# EAGLE design Adafruit Airlift Bitsy Add-On (EAGLE 9.4.2)
COMPANY: ADAFRUIT INDUSTRIES; DRAWN: KTOWN; REV: B
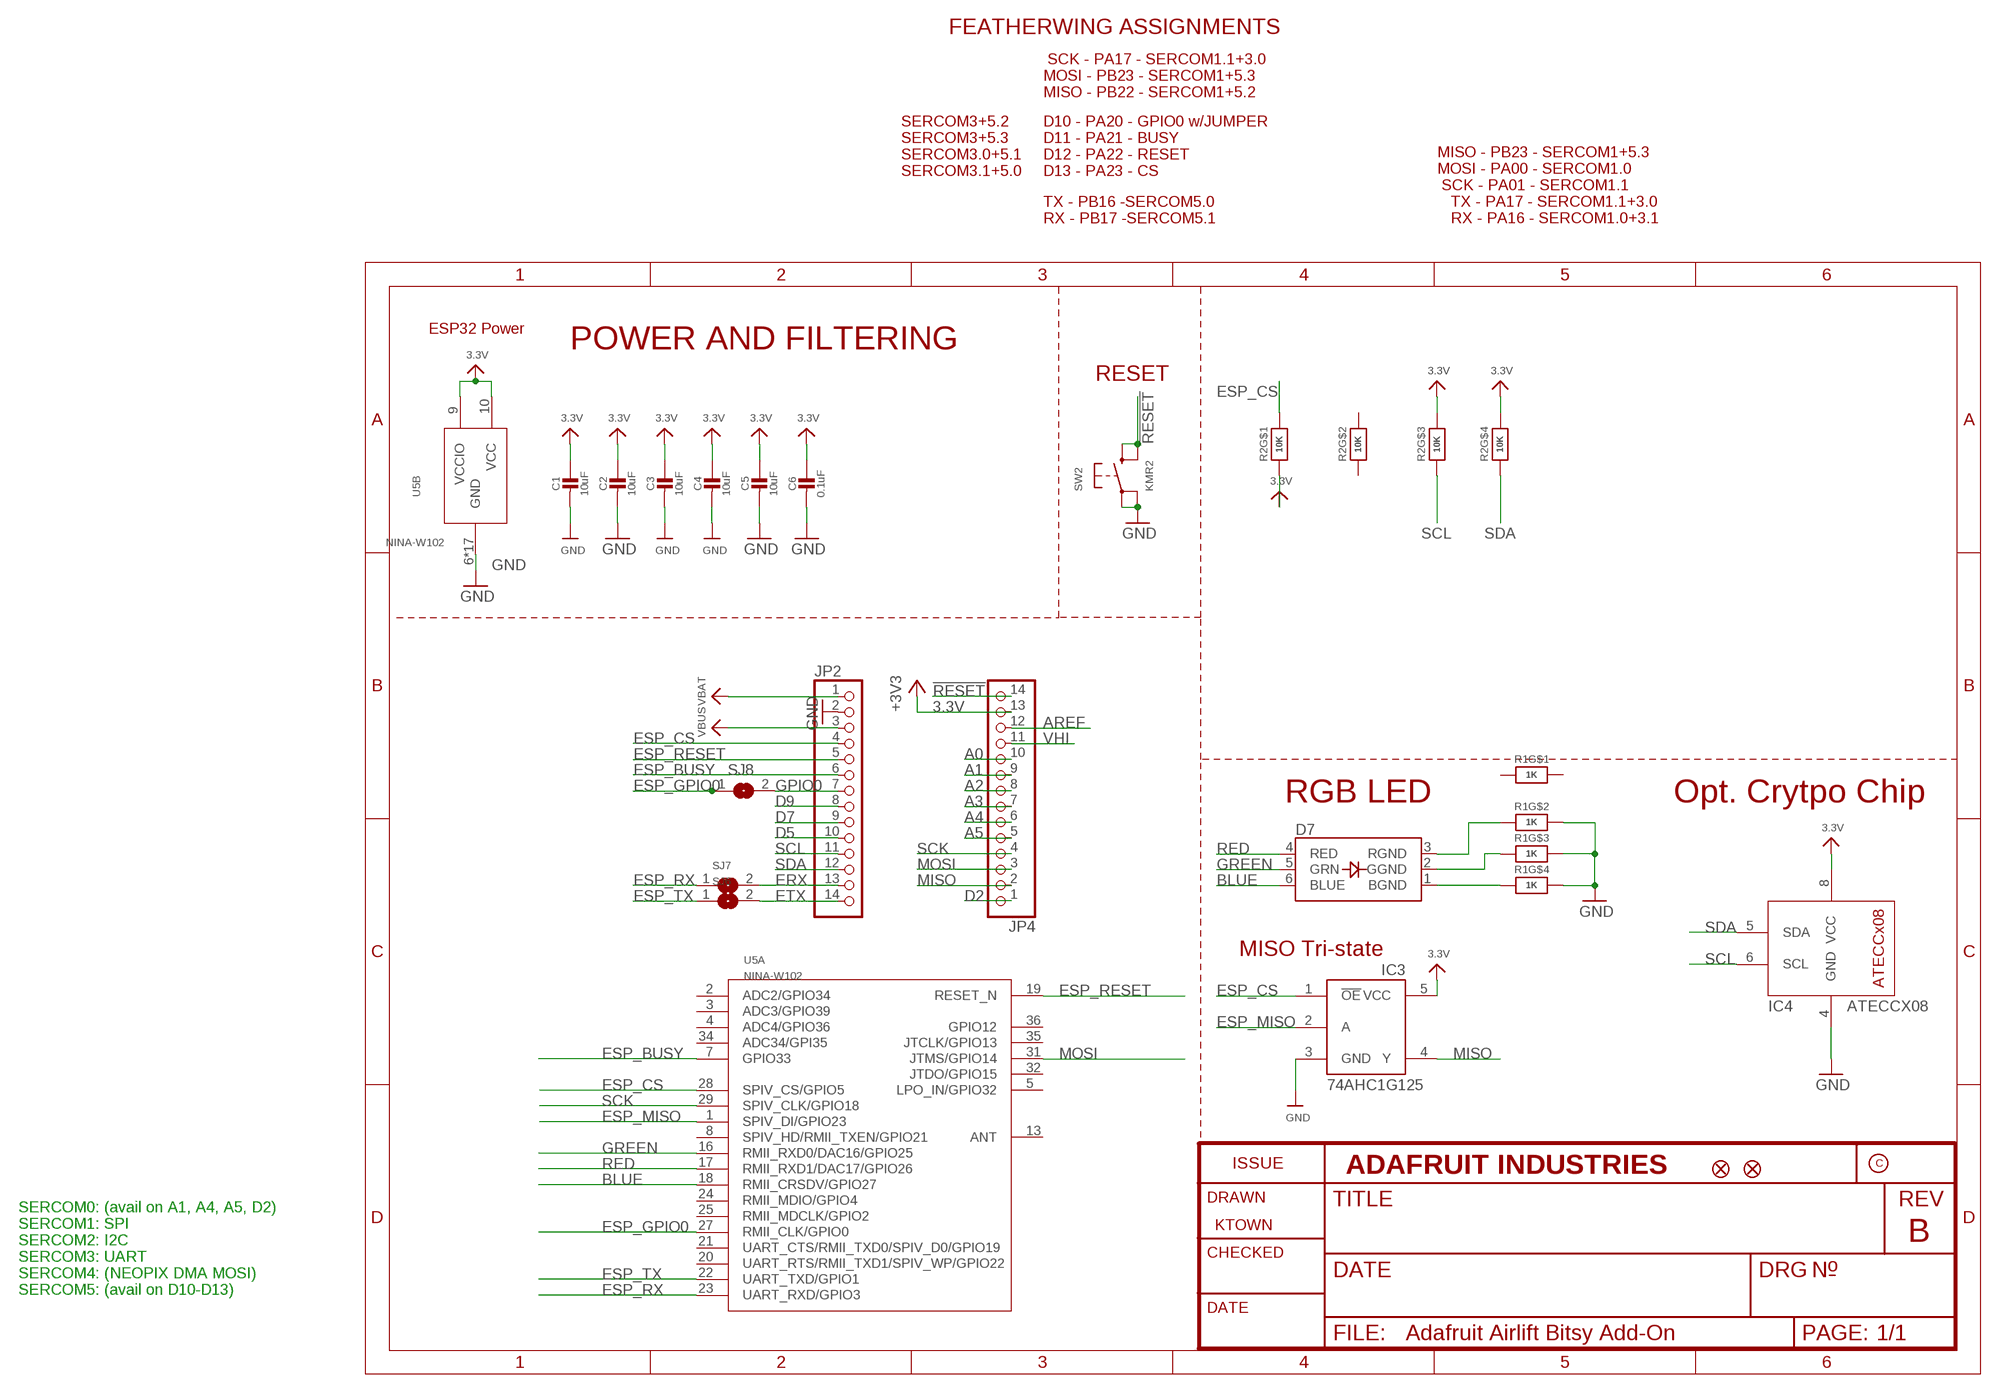
[diagram p0: schematic, sheet 1]

## Parts
C1  10uF  CAP_CERAMIC0805-NOOUTLINE  [0805-NO]
C2  10uF  CAP_CERAMIC0805-NOOUTLINE  [0805-NO]
C3  10uF  CAP_CERAMIC0805-NOOUTLINE  [0805-NO]
C4  10uF  CAP_CERAMIC0805-NOOUTLINE  [0805-NO]
C5  10uF  CAP_CERAMIC0805-NOOUTLINE  [0805-NO]
C6  0.1uF  CAP_CERAMIC0603_NO  [0603-NO]
D7  LED_RGB_PLCC63535  [RGBLED_3535_PLCC6]
IC3  74AHC1G125  [SOT23-5L]
IC4  ATECCX08  [SOIC8_150MIL]
JP2  HEADER-1X14  [1X14_ROUND70]
JP4  HEADER-1X14  [1X14_ROUND70]
R1  1K  RESISTOR_4PACK_NO  [RESPACK_4X0603_NO]
R2  10K  RESISTOR_4PACK_NO  [RESPACK_4X0603_NO]
SJ6  SOLDERJUMPER  [SOLDERJUMPER_ARROW_NOPASTE]
SJ7  SOLDERJUMPER  [SOLDERJUMPER_ARROW_NOPASTE]
SJ8  SOLDERJUMPER  [SOLDERJUMPER_ARROW_NOPASTE]
SW2  KMR2  SWITCH_TACT_SMT4.6X2.8  [BTN_KMR2_4.6X2.8]
U5  NINA-W102  NINA-W10X-102NINA-W10X  [ARDUINO-UCS&SOCS_NINA-W1X]
U$34  FIDUCIAL_1MM  [FIDUCIAL_1MM]
U$35  FIDUCIAL_1MM  [FIDUCIAL_1MM]

## Nets
3.3V: C1.1 C2.1 C3.1 C4.1 C5.1 C6.1 IC3.5(VCC) IC4.8(VCC) JP4.13 R2.1 R2.5 R2.6 U5.9(B:VCCIO) U5.10(B:VCC) ; supply symbol labelled +3V3
!RESET: JP4.14 SW2.B'(S1) SW2.B(S)
A0: JP4.10
A1: JP4.9
A2: JP4.8
A3: JP4.7
A4: JP4.6
A5: JP4.5
AREF: JP4.12
BLUE: D7.6(BLUE) U5.18(A:RMII_CRSDV/GPIO27)
D2: JP4.1
D5: JP2.10
D7: JP2.9
D9: JP2.8
ERX: JP2.13 SJ7.2
ESP_BUSY: JP2.6 U5.7(A:GPIO33)
ESP_CS: IC3.1(!OE) JP2.4 R2.8 U5.28(A:SPIV_CS/GPIO5)
ESP_GPIO0: SJ8.1 U5.27(A:RMII_CLK/GPIO0)
ESP_MISO: IC3.2(A) U5.1(A:SPIV_DI/GPIO23)
ESP_RESET: JP2.5 U5.19(A:RESET_N)
ESP_RX: SJ7.1 U5.23(A:UART_RXD/GPIO3)
ESP_TX: SJ6.1 U5.22(A:UART_TXD/GPIO1)
ETX: JP2.14 SJ6.2
GND: C1.2 C2.2 C3.2 C4.2 C5.2 C6.2 IC3.3(GND) IC4.4(GND) JP2.2 R1.5 R1.6 R1.7 SW2.A'(P1) SW2.A(P) U5.6(B:GND) U5.12(B:GND) U5.14(B:GND) U5.26(B:GND) U5.30(B:GND) U5.GND@1(B:GND) U5.GND@2(B:GND) U5.GND@3(B:GND) U5.GND@4(B:GND) U5.GND@5(B:GND) U5.GND@6(B:GND) U5.GND@7(B:GND) U5.GND@8(B:GND) U5.GND@9(B:GND) U5.GND@10(B:GND) U5.GND@11(B:GND) U5.GND@12(B:GND)
GPIO0: JP2.7 SJ8.2
GREEN: D7.5(GRN) U5.16(A:RMII_RXD0/DAC16/GPIO25)
MISO: IC3.4(Y) JP4.2
MOSI: JP4.3 U5.31(A:JTMS/GPIO14)
N$5: D7.1(BGND) R1.4
N$6: D7.2(GGND) R1.3
N$7: D7.3(RGND) R1.2
RED: D7.4(RED) U5.17(A:RMII_RXD1/DAC17/GPIO26)
SCK: JP4.4 U5.29(A:SPIV_CLK/GPIO18)
SCL: IC4.6(SCL) JP2.11 R2.3
SDA: IC4.5(SDA) JP2.12 R2.4
VBAT: JP2.1
VBUS: JP2.3
VHI: JP4.11
Unconnected: R1.1 R1.8 R2.2 R2.7 U5.2(A:ADC2/GPIO34) U5.3(A:ADC3/GPIO39) U5.4(A:ADC4/GPIO36) U5.5(A:LPO_IN/GPIO32) U5.8(A:SPIV_HD/RMII_TXEN/GPIO21) U5.13(A:ANT) U5.20(A:UART_RTS/RMII_TXD1/SPIV_WP/GPIO22) U5.21(A:UART_CTS/RMII_TXD0/SPIV_D0/GPIO19) U5.24(A:RMII_MDIO/GPIO4) U5.25(A:RMII_MDCLK/GPIO2) U5.32(A:JTDO/GPIO15) U5.34(A:ADC34/GPI35) U5.35(A:JTCLK/GPIO13) U5.36(A:GPIO12)

## Notes on the sheet
- FEATHERWING ASSIGNMENTS
- SCK - PA17 - SERCOM1.1+3.0
  MOSI - PB23 - SERCOM1+5.3
  MISO - PB22 - SERCOM1+5.2
- SERCOM3+5.2
  SERCOM3+5.3
  SERCOM3.0+5.1
  SERCOM3.1+5.0
- D10 - PA20 - GPIO0 w/JUMPER
  D11 - PA21 - BUSY
  D12 - PA22 - RESET
  D13 - PA23 - CS
- TX - PB16 -SERCOM5.0
  RX - PB17 -SERCOM5.1
- MISO - PB23 - SERCOM1+5.3
  MOSI - PA00 - SERCOM1.0
   SCK - PA01 - SERCOM1.1
     TX - PA17 - SERCOM1.1+3.0  
     RX - PA16 - SERCOM1.0+3.1
- ESP32 Power
- POWER AND FILTERING
- RESET
- RGB LED | Opt. Crytpo Chip
- MISO Tri-state
- SERCOM0: (avail on A1, A4, A5, D2)
  SERCOM1: SPI
  SERCOM2: I2C
  SERCOM3: UART
  SERCOM4: (NEOPIX DMA MOSI)
  SERCOM5: (avail on D10-D13)

## Library data of the parts
C1-C6 = microbuilder:CAP_CERAMIC: Ceramic Capacitors For new designs, use the packages preceded by an '_' character since they are more reliable: The following footprints should be used on most boards: _0402 - Standard footprint for regular board layouts _0603 - Standard footprint for regular board layouts _0805 - Standard footprint for regular board layouts _1206 - Standard footprint for regular board layouts For extremely tight-pitch boards where space is at a premium, the following 'micro-pitch' footprints can be used (smaller pads, no silkscreen outline, etc.): _0402MP - Micro-pitch footprint for very dense/compact boards _0603MP - Micro-pitch footprint for very dense/compact boards _0805MP - Micro-pitch footprint for very dense/compact boards _1206MP - Micro-pitch footprint for very dense/compact boards
D7 = microbuilder:LED_RGB_PLCC6: RGB LED Cree CLV6A-FKB - Digikey: CLV6A-FKB-CK1P1G1BB7R3R3TR-ND DC Foreward Current: 20mA Foreward Voltage: R = 2.0, G = 3.2, B = 3.2 Viewing Angle: 120°
IC3 = adafruit:74AHC1G125
IC4 = microbuilder:ATECCX08
JP2 JP4 = microbuilder:HEADER-1X14
R1 R2 = microbuilder:RESISTOR_4PACK: Resistor Packs (4 resistors) 4 x 0603 10K 1/16W - Digikey: YC164J-10KCT-ND
SJ6-SJ8 = microbuilder:SOLDERJUMPER: SMD Solder JUMPER Solder the two pads together to create a connection, or remove the solder to break it. REFLOW - Use this footprint for solder paste and reflow ovens. WAVE - Use this footprint for hand-soldering (larger pads). CLOSED - Has a trace between the two pads to ensure it is closed by default. The trace needs to be cut to disable the jumper, and can be closed again by creating a solder bridge between the two pads.; BOM: EXCLUDE
SW2 = microbuilder:SWITCH_TACT_SMT: SMT Tact Switches 6x6mm - Digikey: P12940SCT-ND KMR2 (4.6x2.8mm) - Digikey: 401-1426-1-ND EVQ-PQHB55 - Light Touch, 160GF (4.5x4.5mm) - Digikey: P8090SCT-ND KMT0 - KMT021 NGJ LHS (etc.) IP68/Waterproof - Digikey: CKN10289CT-ND
U5 = microbuilder:NINA-W10X: uBlox NINA-W10X ESP32 WiFi/BLE module Footprint, Symbol, and Object by Arturo Guadalupi for the Arduino MKRWiFi1010 https://content.arduino.cc/assets/MKRWiFi1010-reference.zip BY-SA; CODE-ARDUINO: 2205; DATASHEET: https://www.u-blox.com/sites/default/files/NINA-W1_DataSheet_%28UBX-17006694%29.pdf; DISTRIBUTOR-LINK: https://www.digikey.com/product-detail/en/u-blox-america-inc/NINA-W102/672-1070-1-ND/7931820; DISTRIBUTOR-PN: 672-1070-1-ND; MANUFACTURER: Ublocks; MANUFACTURER-PN: NINA-W102
U$34 U$35 = microbuilder:FIDUCIAL: Fiducial Alignment Points Various fiducial points for machine vision alignment.; BOM: EXCLUDE

## Board
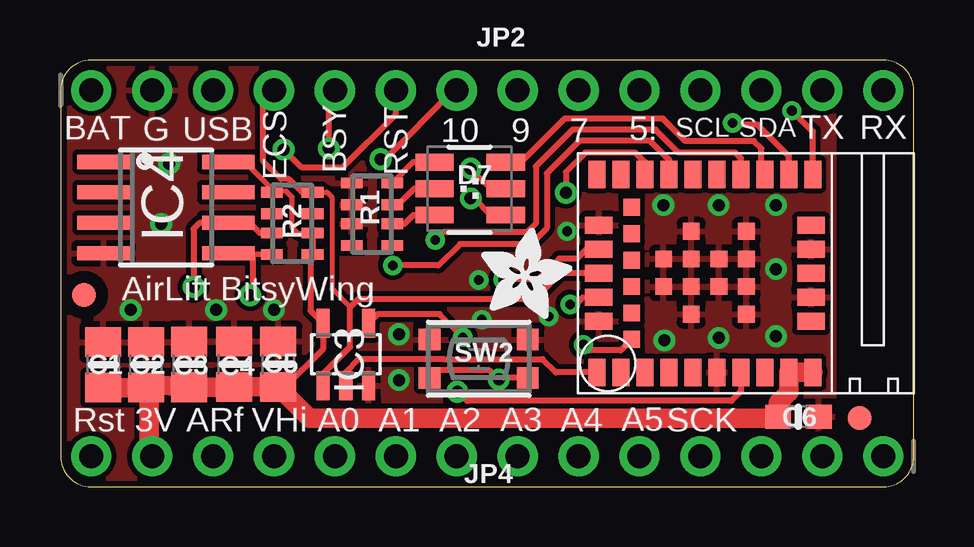
[diagram p1: board, top side]
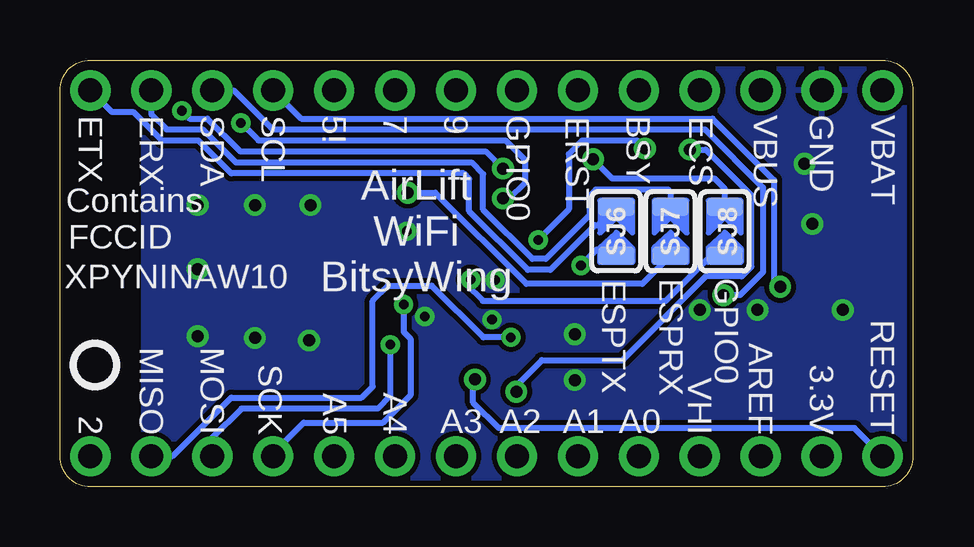
[diagram p2: board, bottom side, seen from below]

Size 35.56 x 17.78 mm. Coordinates in mm from the lower left corner, seen from the top.
Outline: 0,16.51 0,1.27 arc90 1.27,0 34.29,0 arc90 35.56,1.27 35.56,16.51 arc90 34.29,17.78 1.27,17.78 arc90 0,16.51
Copper layers (1*16): Top 0.035mm / dielectric 1.5mm / Bottom 0.035mm
Design rules "adafruit *": minimum track width 8mil, minimum drill 15.5mil, track to track 8mil, track to pad 8mil, pad to pad 8mil, via to via 8mil, smd to smd 8mil, copper to edge 10mil, drill to drill 8mil, minimum pad ring 10mil, minimum via ring 8mil, stop-mask expansion 2mil, vias tented up to drill 20mil, thermal gap 10mil

### Footprints (pad centres in the part's own frame; a part is rotated, then mirrored left to right if it is on the bottom)
0805-NO = smd 1.24 x 1.5: 1 -0.95,0; 2 0.95,0
0603-NO = smd 1.075 x 1: 1 -0.85,0; 2 0.85,0
RGBLED_3535_PLCC6 = smd 0.7 x 1.6: 1 -1.1,-1.458; 2 0,-1.458; 3 1.1,-1.458; 4 1.1,1.508; 5 0,1.508; 6 -1.1,1.508
SOT23-5L = smd 0.55 x 1.2: 1 -0.95,-1.3; 2 0,-1.3; 3 0.95,-1.3; 4 0.95,1.3; 5 -0.95,1.3
SOIC8_150MIL = smd 0.6 x 2.2: 1 -1.905,-2.6; 2 -0.635,-2.6; 3 0.635,-2.6; 4 1.905,-2.6; 5 1.905,2.6; 6 0.635,2.6; 7 -0.635,2.6; 8 -1.905,2.6
1X14_ROUND70 = drill 1 pad 1.676: 1 -16.51,0; 2 -13.97,0; 3 -11.43,0; 4 -8.89,0; 5 -6.35,0; 6 -3.81,0; 7 -1.27,0; 8 1.27,0; 9 3.81,0; 10 6.35,0; 11 8.89,0; 12 11.43,0; 13 13.97,0; 14 16.51,0
RESPACK_4X0603_NO = smd 0.45 x 0.9: 1 -1.3,-0.85; 2 -0.4,-0.85; 3 0.4,-0.85; 4 1.3,-0.85; 5 1.3,0.85; 6 0.4,0.85; 7 -0.4,0.85; 8 -1.3,0.85
SOLDERJUMPER_ARROW_NOPASTE = smd 0.762 x 1.524: 1 -1.016,0; 2 1.016,0
BTN_KMR2_4.6X2.8 = smd 0.9 x 0.9: A 2.05,0.8; A' -2.05,0.8; B 2.05,-0.8; B' -2.05,-0.8
ARDUINO-UCS&SOCS_NINA-W1X = smd 0.7 x 1.15: 1 4.95,4.125; 2 3.95,4.125; 3 2.95,4.125; 4 1.95,4.125; 5 0.95,4.125; 6 -0.05,4.125; 7 -1.05,4.125; 8 -2.05,4.125; 9 -3.05,4.125; 10 -4.05,4.125; 16 -4.05,-4.125; 17 -3.05,-4.125; 18 -2.05,-4.125; 19 -1.05,-4.125; 20 -0.05,-4.125; 21 0.95,-4.125; 22 1.95,-4.125; 23 2.95,-4.125; 24 3.95,-4.125; 25 4.95,-4.125 | smd 1.15 x 0.7: 11 -3.975,2; 12 -3.975,1; 13 -3.975,0; 14 -3.975,-1; 15 -3.975,-2; 26 4.875,-2; 27 4.875,-1; 28 4.875,0; 29 4.875,1; 30 4.875,2 | smd 0.7 x 0.7: 31 3.5,2.75; 32 3.5,1.65; 33 3.5,0.55; 34 3.5,-0.55; 35 3.5,-1.65; 36 3.5,-2.75; GND@1 -1.28,1.7; GND@2 -1.28,0.55; GND@3 -1.28,-0.6; GND@4 -1.28,-1.75; GND@5 -0.13,0.55; GND@6 -0.13,-0.6; GND@7 1.02,1.7; GND@8 1.02,0.55; GND@9 1.02,-0.6; GND@10 1.02,-1.75; GND@11 2.17,0.55; GND@12 2.17,-0.6
FIDUCIAL_1MM = smd 1 x 1: 1 0,0

### Placement (x,y rotation side)
C1  1.78,5.08 90 top
C2  3.56,5.08 90 top
C3  5.36,5.09 90 top
C4  7.24,5.11 90 top
C5  9.07,5.11 90 top
C6  30.76,2.92 0 top
D7  17.04,12.42 270 top
IC3  11.89,5.51 0 top
IC4  4.39,11.63 270 top
JP2  17.78,16.51 0 top
JP4  17.78,1.27 180 top
R1  12.98,11.35 90 top
R2  9.65,10.97 270 top
SJ6  12.37,10.64 90 bottom
SJ7  10.11,10.64 90 bottom
SJ8  7.85,10.64 90 bottom
SW2  17.42,5.33 0 top
U5  27.3,8.89 180 top
U$6  [PCBFEAT-REV-040]  34.1,5.08 180 bottom
U$34  33.3,2.87 270 top
U$35  0.97,7.99 90 top
U$62  [ADAFRUIT_3.5MM]  17.53,6.99 0 top

### Tracks (layer width: path | path; a pad name or v marks a point on that pad's centre or on a via)
3.3V
  Top 0.203: R2.6 10.47,10.54 9.91,10.54 9.65,10.79 9.65,12.06 9.4,12.32 8.85,12.32 R2.1 8.8,12.41 7.67,13.54 IC4.8
  Top 0.254: R2.6 R2.5 10.41,9.67 10.41,7.33 IC3.5 10.94,5.73 9.36,4.16 C5.1
  Top 0.813: C1.1 C2.1 3.58,4.15 3.7,4.14 | U5.10 U5.9 30.36,3.94 29.91,3.49 C6.1 29.91,2.86 29.9,2.85 10.38,2.85 C5.1 C4.1 7.23,4.14 C3.1 3.7,4.27 3.7,4.14 | JP4.13 3.7,1.38 3.7,4.14
!RESET  (via drill 0.5)
  Top 0.254: SW2.B' 15.69,4.85 17.88,4.85 v18.26,4.47 18.33,4.53 SW2.B
  Bottom 0.254: JP4.14 2.44,2.44 17.27,2.44 18.34,3.51 18.34,4.16 18.26,4.23 v18.26,4.47
BLUE
  Top 0.254: U5.18 29.21,13.16 29.21,14.1 28.91,14.4 26.05,14.4 25.11,15.34 21,15.34 19.19,13.52 D7.6
ERX
  Bottom 0.254: JP2.13 31.75,15.52 31.12,14.88 29.6,14.88 28.23,13.51 18.41,13.51 17.92,13.02 17.92,11.54 15.87,9.5 15.3,9.5 13.49,11.31 13.49,12.11 13.22,12.38 10.2,12.38 10.11,12.29 SJ7.2
ESP_BUSY  (via drill 0.5)
  Top 0.254: U5.7 28.36,3.97 27.96,3.58 16.94,3.58 16.57,3.96 v16.54,3.96 | JP2.6 13.97,15.53 11.76,13.31 10.03,13.31 v9.3,14.05
  Bottom 0.254: v9.3,14.05 8.64,14.05 6.73,12.14 6.73,9.17 7.14,8.76 8.64,8.76 12.12,5.28 15.47,5.28 16.54,4.21 v16.54,3.96
ESP_CS
  Top 0.203: R2.8 11.1,12.27 11.3,12.06 11.3,8.25 12.06,7.49
  Top 0.254: JP2.4 8.42,16.04 8.42,13.59 9.19,12.83 9.5,12.83 10.05,12.27 R2.8 | IC3.1 10.94,4.7 12.06,5.83 12.06,7.49 12.39,7.81 19.74,7.81 20.83,8.89 U5.28
ESP_GPIO0  (via drill 0.4)
  Top 0.254: v18.44,8.64 19.91,8.64 20.78,9.51 21.54,9.51 21.92,9.89 U5.27
  Bottom 0.254: SJ8.1 8.42,9.63 10.3,7.74 17.93,7.74 18.63,8.45 v18.44,8.64
ESP_MISO
  Top 0.254: U5.1 20.64,4.76 20.09,5.31 17.87,5.31 15.97,5.31 15.96,5.31 12.43,5.31 11.89,4.78 IC3.2
ESP_RESET  (via drill 0.4, 0.5)
  Top 0.254: U5.19 28.36,13.68 28.12,13.92 25.76,13.92 24.8,14.88 21.34,14.88 19.81,13.34 19.81,10.96 19.44,10.6 15.93,10.6 v15.62,10.29 | JP2.5 11.18,16.26 v11.18,14.1
  Bottom 0.254: v11.18,14.1 11.51,14.43 13.79,14.43 14.35,13.87 14.35,11.56 v15.62,10.29
ESP_RX  (via drill 0.5)
  Top 0.254: U5.23 24.36,13.52 23.96,13.92 21.87,13.92 21.06,13.11 v21.06,12.25
  Bottom 0.254: SJ7.1 11.28,8.45 16.12,8.45 19.92,12.25 v21.06,12.25
ESP_TX  (via drill 0.4)
  Top 0.254: U5.22 25.36,13.63 24.57,14.42 21.63,14.42 20.27,13.05 20.27,10.77 19.6,10.11 16.64,10.11 15.75,9.22 v13.84,9.22
  Bottom 0.254: v13.84,9.22 13.18,9.88 12.92,9.63 SJ6.1
ETX
  Bottom 0.254: JP2.14 33.4,15.62 32.51,15.62 31.32,14.43 29.79,14.43 28.42,13.06 18.73,13.06 18.5,12.83 18.5,11.48 16.06,9.04 15.11,9.04 13.26,10.9 13.13,10.9 SJ6.2
GND  (via drill 0.4, 0.5)
  other vias: 21.11,10.64 29.82,11.73 29.82,9.07 29.82,6.27 25.17,6.1 25.12,11.73 27.43,11.73 27.43,6.2 4.19,10.95 4.52,13.46 2.92,7.37 8.89,7.37 14.1,6.35 14.1,4.45 17.42,8.61 17.55,6.96 6.48,7.37 20.35,7.09
  pour Bottom: 0,17.78 32.08,17.78 32.08,0 0,0
  pour Top: 0,17.78 32.21,17.78 32.21,0 0,0
GPIO0  (via drill 0.5)
  Top 0.254: v13.34,13.64 13.51,13.64 16.38,16.51 JP2.7
  Bottom 0.254: v13.34,13.64 12.54,12.84 8.27,12.84 7.85,12.42 SJ8.2
GREEN  (via drill 0.4, 0.5)
  Top 0.254: U5.16 31.36,14.79 v30.48,15.67 | D7.5 17.93,12.42 v17.09,13.26
  Bottom 0.254: v30.48,15.67 30.16,15.34 29.41,15.34 28.04,13.97 17.8,13.97 v17.09,13.26
MISO  (via drill 0.39)
  Top 0.254: IC3.4 13.22,7.19 15.79,7.19 v16.76,6.22
  Bottom 0.254: JP4.2 30.86,1.27 28.42,3.71 22.99,3.71 22.53,4.17 22.53,7.75 21.89,8.38 20.07,8.38 17.91,6.22 v16.76,6.22
MOSI  (via drill 0.4)
  Top 0.254: U5.31 23.35,5.68 22.03,5.68 v21.79,5.92
  Bottom 0.254: v21.79,5.92 21.79,3.76 22.3,3.25 27.99,3.25 29.21,2.03 JP4.3
N$5
  Top 0.254: D7.1 14.7,13.52 R1.4
N$6
  Top 0.254: D7.2 14.74,12.42 14.07,11.75 R1.3
N$7
  Top 0.254: D7.3 14.7,11.32 14.33,10.95 R1.2
RED  (via drill 0.4, 0.5)
  Top 0.254: U5.17 30.36,13.76 29.03,15.08 28.09,15.08 v28.02,15.16 | D7.4 17.92,11.32 17.22,12.01 v17.09,12.01
  Bottom 0.254: v28.02,15.16 27.29,14.43 16.98,14.43 16.18,13.63 16.18,12.65 16.82,12.01 v17.09,12.01
SCK  (via drill 0.4)
  Top 0.254: v21.23,7.6 21.48,7.6 21.77,7.89 U5.29
  Bottom 0.254: JP4.4 26.67,1.4 25.4,2.67 22.09,2.67 20.95,3.81 20.95,6.17 21.23,6.46 v21.23,7.6
SCL  (via drill 0.5)
  Top 0.254: v5.54,8.33 5.54,10.74 5.79,11 IC4.6 7.87,10.99 8.29,10.57 R2.3
  Bottom 0.254: JP2.11 25.5,15.34 8.36,15.34 5.79,12.78 5.79,8.59 v5.54,8.33
SDA  (via drill 0.5)
  Top 0.254: v7.9,7.98 8.01,8.09 8.01,9.6 7.88,9.73 IC4.5 7.02,9.7 R2.4
  Bottom 0.254: JP2.12 28.32,16.51 26.7,14.88 8.67,14.88 6.25,12.46 6.25,8.95 7.21,7.98 v7.9,7.98

### Text on the board
tPlace: BAT | G | USB | 10 | 9 | 7 | 5! | SCL | SDA | TX | RX | ECS | BSY | RST | AirLift BitsyWing | Rst | 3V | ARf | VHi | A0 | A1 | A2 | A3 | A4 | A5 | SCK
bPlace: VBAT | GND | VBUS | ECS | BSY | ERST | GPIO0 | 9 | 7 | 5! | SCL | SDA | ERX | ETX | AirLift / WiFi / BitsyWing | Contains | FCCID | GPIO0 | ESPRX | ESPTX | XPYNINAW10 | A0 | A1 | A2 | A3 | RESET | 3.3V | AREF | VHI | A4 | A5 | SCK | MOSI | MISO | 2
Reference: LiPo Backpack